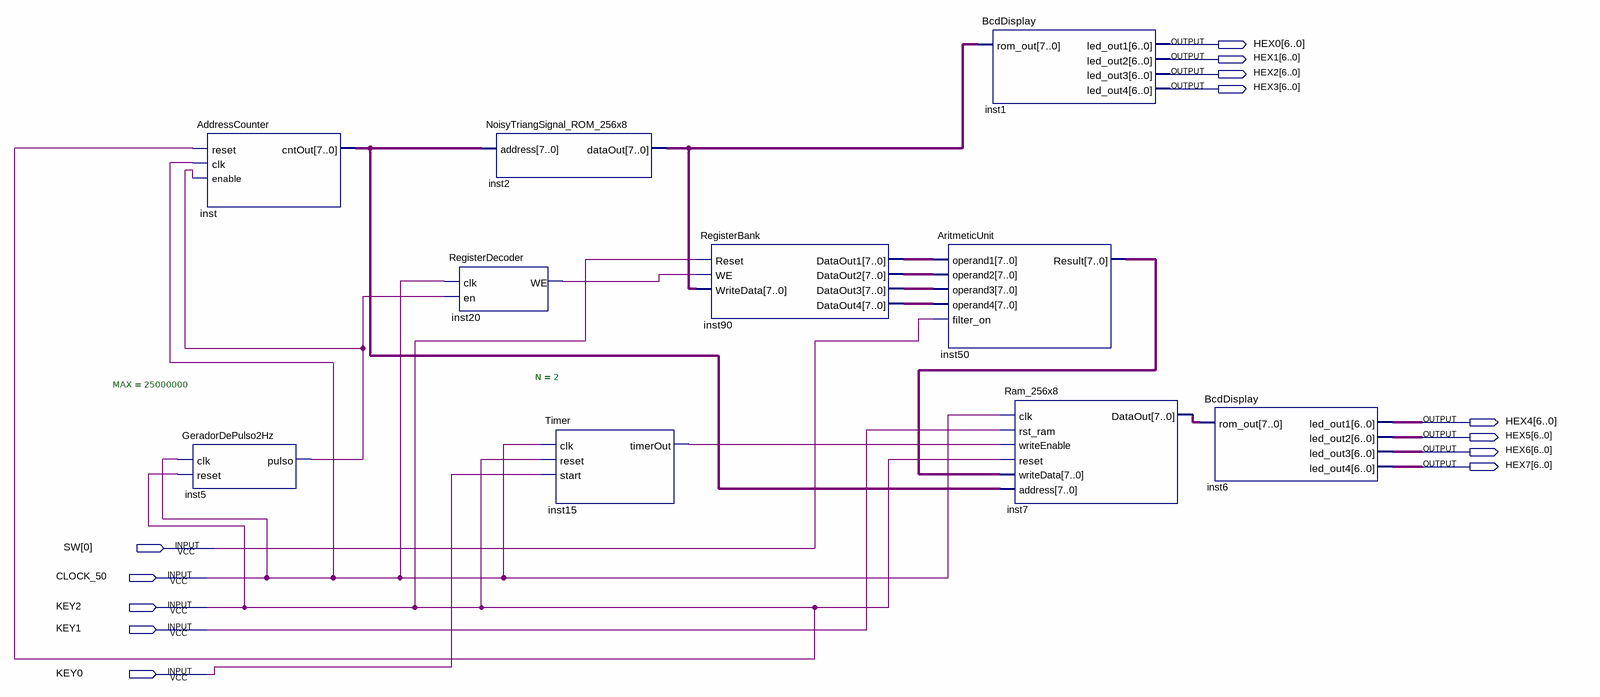
[diagram p0: schematic sheet]
// Quartus schematic ProjetoFinal.bdf as structural Verilog: 10 symbols, 13 pins
module ProjetoFinal (
  input  [0:0] SW,
  input  CLOCK_50,
  input  KEY2,
  input  KEY1,
  input  KEY0,
  output [6:0] HEX0,
  output [6:0] HEX1,
  output [6:0] HEX2,
  output [6:0] HEX3,
  output [6:0] HEX4,
  output [6:0] HEX5,
  output [6:0] HEX6,
  output [6:0] HEX7
);

  wire inst5_pulso, inst15_timerout, inst20_we;
  wire [7:0] inst2_dataout, inst7_dataout, inst50_result, inst90_dataout1, inst90_dataout2, inst90_dataout3,
       inst90_dataout4, inst_cntout;

  AddressCounter inst (.reset(KEY2), .clk(CLOCK_50), .enable(inst5_pulso), .cntOut(inst_cntout));
  GeradorDePulso2Hz #(.MAX(25000000)) inst5 (.clk(CLOCK_50), .reset(KEY2), .pulso(inst5_pulso));
  NoisyTriangSignal_ROM_256x8 inst2 (.address(inst_cntout), .dataOut(inst2_dataout));
  RegisterDecoder inst20 (.clk(CLOCK_50), .en(inst5_pulso), .WE(inst20_we));
  Timer #(.N(2)) inst15 (.clk(CLOCK_50), .reset(KEY2), .start(KEY0), .timerOut(inst15_timerout));
  RegisterBank inst90 (
    .Reset(KEY2), .WE(inst20_we), .WriteData(inst2_dataout), .DataOut1(inst90_dataout1),
    .DataOut2(inst90_dataout2), .DataOut3(inst90_dataout3), .DataOut4(inst90_dataout4));
  AritmeticUnit inst50 (
    .operand1(inst90_dataout1), .operand2(inst90_dataout2), .operand3(inst90_dataout3),
    .operand4(inst90_dataout4), .filter_on(SW[0]), .Result(inst50_result));
  BcdDisplay inst1 (.rom_out(inst2_dataout), .led_out1(HEX0), .led_out2(HEX1), .led_out3(HEX2), .led_out4(HEX3));
  Ram_256x8 inst7 (
    .clk(CLOCK_50), .rst_ram(KEY1), .writeEnable(inst15_timerout), .reset(KEY2), .writeData(inst50_result),
    .address(inst_cntout), .DataOut(inst7_dataout));
  BcdDisplay inst6 (.rom_out(inst7_dataout), .led_out1(HEX4), .led_out2(HEX5), .led_out3(HEX6), .led_out4(HEX7));
endmodule
